# EAGLE design gps (EAGLE 7.5.0)
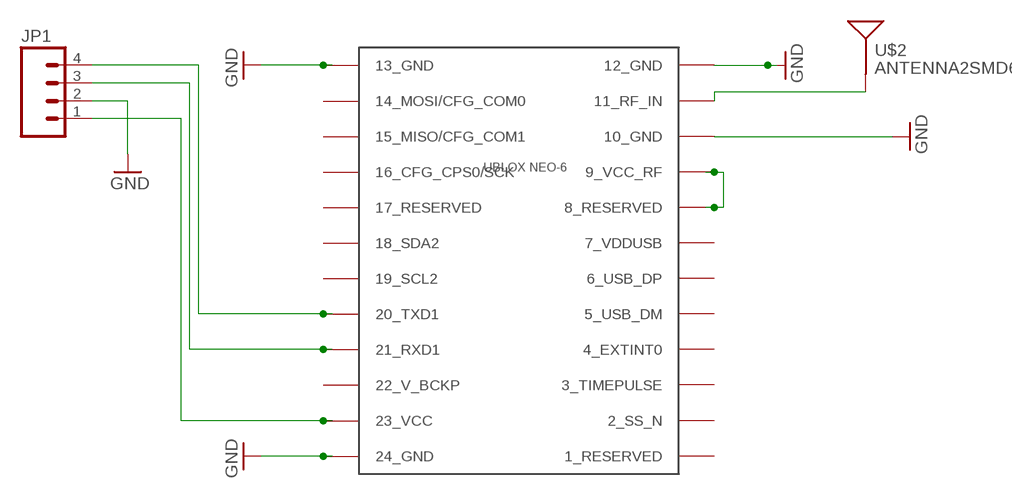
[diagram p0: schematic, sheet 1]

## Parts
JP1  M04LOCK_LONGPADS  [1X04_LOCK_LONGPADS]
U$1  UBLOX_NEO-6  [UBLOX_NEO-6P]
U$2  ANTENNA2SMD6  [ANTENNA-CHIP6]

## Nets
GND: JP1.2 U$1.10_GND U$1.12_GND U$1.13_GND U$1.24_GND
N$1: JP1.1 U$1.23_VCC
N$3: JP1.3 U$1.21_RXD1
N$4: JP1.4 U$1.20_TXD1
N$5: U$1.11_RF_IN U$2.1(SIGNAL)
N$7: U$1.8_RESERVED U$1.9_VCC_RF
Unconnected: U$1.1_RESERVED U$1.2_SS_N U$1.3_TIMEPULSE U$1.4_EXTINT0 U$1.5_USB_DM U$1.6_USB_DP U$1.7_VDDUSB U$1.14_MOSI/CFG_COM0 U$1.15_MISO/CFG_COM1 U$1.16_CFG_CPS0/SCK U$1.17_RESERVED U$1.18_SDA2 U$1.19_SCL2 U$1.22_V_BCKP

## Library data of the parts
JP1 = SparkFun-Connectors:M04: Header 4 Standard 4-pin 0.1" header. Use with straight break away headers (SKU : PRT-00116), right angle break away headers (PRT-00553), swiss pins (PRT-00743), machine pins (PRT-00117), and female headers (PRT-00115). Molex polarized connector foot print use with SKU : PRT-08231 with associated crimp pins and housings. 1MM SMD Version SKU: PRT-10208
U$1 = Ava:UBLOX_NEO-6: UBLOX NEO-6 GPS MODULE Author Anthony Stirk / http://ava.upuaut.net http://www.u-blox.com/images/downloads/Product_Docs/LEA-6_NEO-6_MAX_HardwareIntegrationManual_%28GPS.G6-HW-09007%29.pdf http://www.u-blox.com/images/downloads/Product_Docs/NEO-6_DataSheet_%28GPS.G6-HW-09005%29.pdf
U$2 = SparkFun-RF:ANTENNA2: Chip antenna Single endded antenna. Common with smaller chip antennas. CHIP4 package is the GPS Chip Antenna SKU: GPS-08418. CHIP5 package is 2.4GHz chip antenna SKU: WRL-00144.

## Board
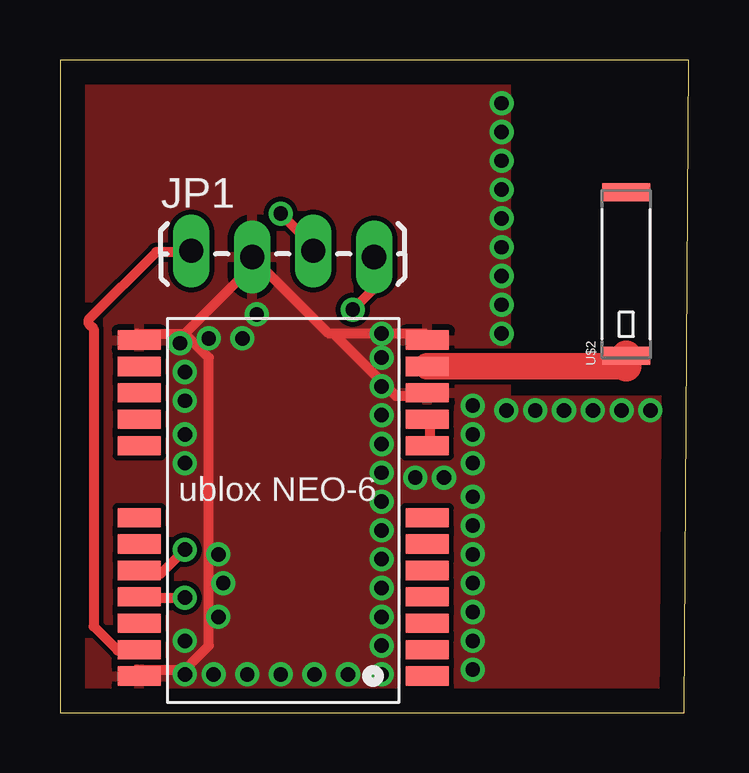
[diagram p1: board, top side]
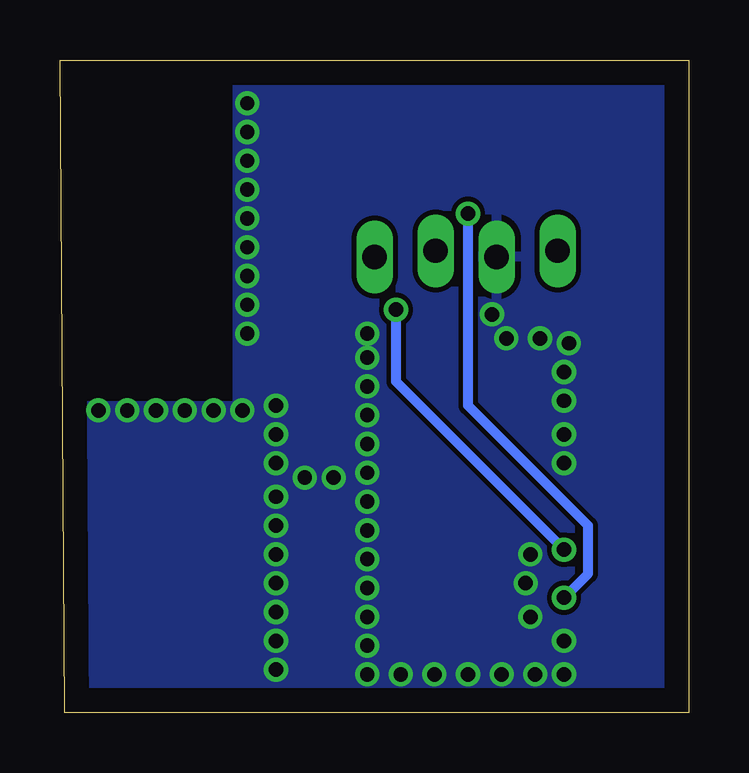
[diagram p2: board, bottom side, seen from below]

Size 26.2 x 27.2 mm. Coordinates in mm from the lower left corner, seen from the top.
Outline: 0,0 26,0 26.2,27.2 0,27.2 0,0
Copper layers (1*16): Top 0.035mm / dielectric 1.5mm / Bottom 0.035mm
Design rules "default": minimum track width 10mil, minimum drill 24mil, track to track 8mil, track to pad 8mil, pad to pad 8mil, via to via 8mil, smd to smd 8mil, copper to edge 40mil, drill to drill 8mil, minimum pad ring 10mil, minimum via ring 8mil, stop-mask expansion 4mil, vias tented up to drill 0mil, thermal gap 10mil

### Footprints (pad centres in the part's own frame; a part is rotated, then mirrored left to right if it is on the bottom)
1X04_LOCK_LONGPADS = drill 1.016 long: 1 0,0; 2 2.54,-0.254; 3 5.08,0; 4 7.62,-0.254
UBLOX_NEO-6P = smd 1.8 x 0.8: 1_RESERVED 6.4,-7.4; 2_SS_N 6.4,-6.3; 3_TIMEPULSE 6.4,-5.2; 4_EXTINT0 6.4,-4.1; 5_USB_DM 6.4,-3; 6_USB_DP 6.4,-1.9; 7_VDDUSB 6.4,-0.8; 8_RESERVED 6.4,2.2; 9_VCC_RF 6.4,3.3; 10_GND 6.4,4.4; 11_RF_IN 6.4,5.5; 12_GND 6.4,6.6; 13_GND -5.6,6.6; 14_MOSI/CFG_COM0 -5.6,5.5; 15_MISO/CFG_COM1 -5.6,4.4; 16_CFG_CPS0/SCK -5.6,3.3; 17_RESERVED -5.6,2.2; 18_SDA2 -5.6,-0.8; 19_SCL2 -5.6,-1.9; 20_TXD1 -5.6,-3; 21_RXD1 -5.6,-4.1; 22_V_BCKP -5.6,-5.2; 23_VCC -5.6,-6.3; 24_GND -5.6,-7.4
ANTENNA-CHIP6 = smd 0.75 x 2: 1 -3.4,0; NC 3.4,0

### Placement (x,y rotation side)
JP1  5.47,19.25 0 top
U$1  8.9,8.93 0 top
U$2  23.59,18.28 90 top

### Tracks (layer width: path | path; a pad name or v marks a point on that pad's centre or on a via)
GND  (via drill 0.6)
  Top 0.406: 8.2,18.8 11.2,15.8 11.4,15.8 | 11.4,15.8 v13.4,15.8 15.2,15.8 U$1.12_GND | 5.2,15.8 8.2,18.8 | 5.2,15.8 3.2,15.8 U$1.13_GND | 8.2,18.8 JP1.2 | 5.2,15.8 6.2,14.8 6.2,2.8 5.2,1.8 3.2,1.8 U$1.24_GND | 15,13.2 14,13.2 11.4,15.8
  other vias: 13.4,10 14.8,9.8 16,9.8 17.2,10.4 17.2,9 17.2,7.8 17.2,6.6 17.2,5.4 17.2,4.2 17.2,1.8 10.6,1.6 9.2,1.6 7.8,1.6 6.4,1.6 5.2,1.6 5.2,3 6.6,4 6.8,5.4 6.6,6.6 5.2,10.4 5.2,11.6 5.2,13 5.2,14.2 5,15.4 6.2,15.6 7.6,15.6 8.2,16.6 17.2,12.8 17.2,11.6 13.4,14.8 13.4,13.6 13.4,12.4 13.4,11.2 13.4,8.8 13.4,7.6 13.4,6.4 13.4,5.2 13.4,4 13.4,2.8 13.4,1.6 12,1.6 17.2,3 18.4,25.4 18.4,24.2 18.4,23 18.4,21.8 18.4,20.6 18.4,19.4 18.6,12.6 19.8,12.6 21,12.6 22.2,12.6 23.4,12.6 24.6,12.6 18.4,15.8 18.4,17 18.4,18.2
  pour Top: 0,27.2 0,0 26,0 26,12.8 26.2,13 18.6,13 18.6,27 0.2,27
  pour Bottom: 0,27.2 0,0 26,0 26,12.8 18.8,12.8 18.8,27 0.4,27 0.2,27.2
N$1
  Top 0.406: JP1.1 5.4,19.2 4,19.2 1.2,16.4 1.2,16.2 1.4,16 1.4,3.6 2.4,2.6 3.2,2.6 U$1.23_VCC
N$3  (via drill 0.6)
  Top 0.406: v9.2,20.8 10.2,19.8 JP1.3 | v5.2,4.8 3.2,4.8 U$1.21_RXD1
  Bottom 0.406: v9.2,20.8 9.2,12.8 4.2,7.8 4.2,5.8 v5.2,4.8
N$4  (via drill 0.6)
  Top 0.406: v12.2,16.8 13.2,17.8 13.2,18.8 JP1.4 | v5.2,6.8 4.2,5.8 3.2,5.8 U$1.20_TXD1
  Bottom 0.406: v12.2,16.8 12.2,13.8 v5.2,6.8
N$5
  Top 1.1: U$1.11_RF_IN 23.59,14.43
  Top 1.27: 23.59,14.43 U$2.1
N$7
  Top 0.406: U$1.8_RESERVED 15.4,11.2 15.4,12.2 U$1.9_VCC_RF